# EAGLE design cpu_board (EAGLE 7.2.0)
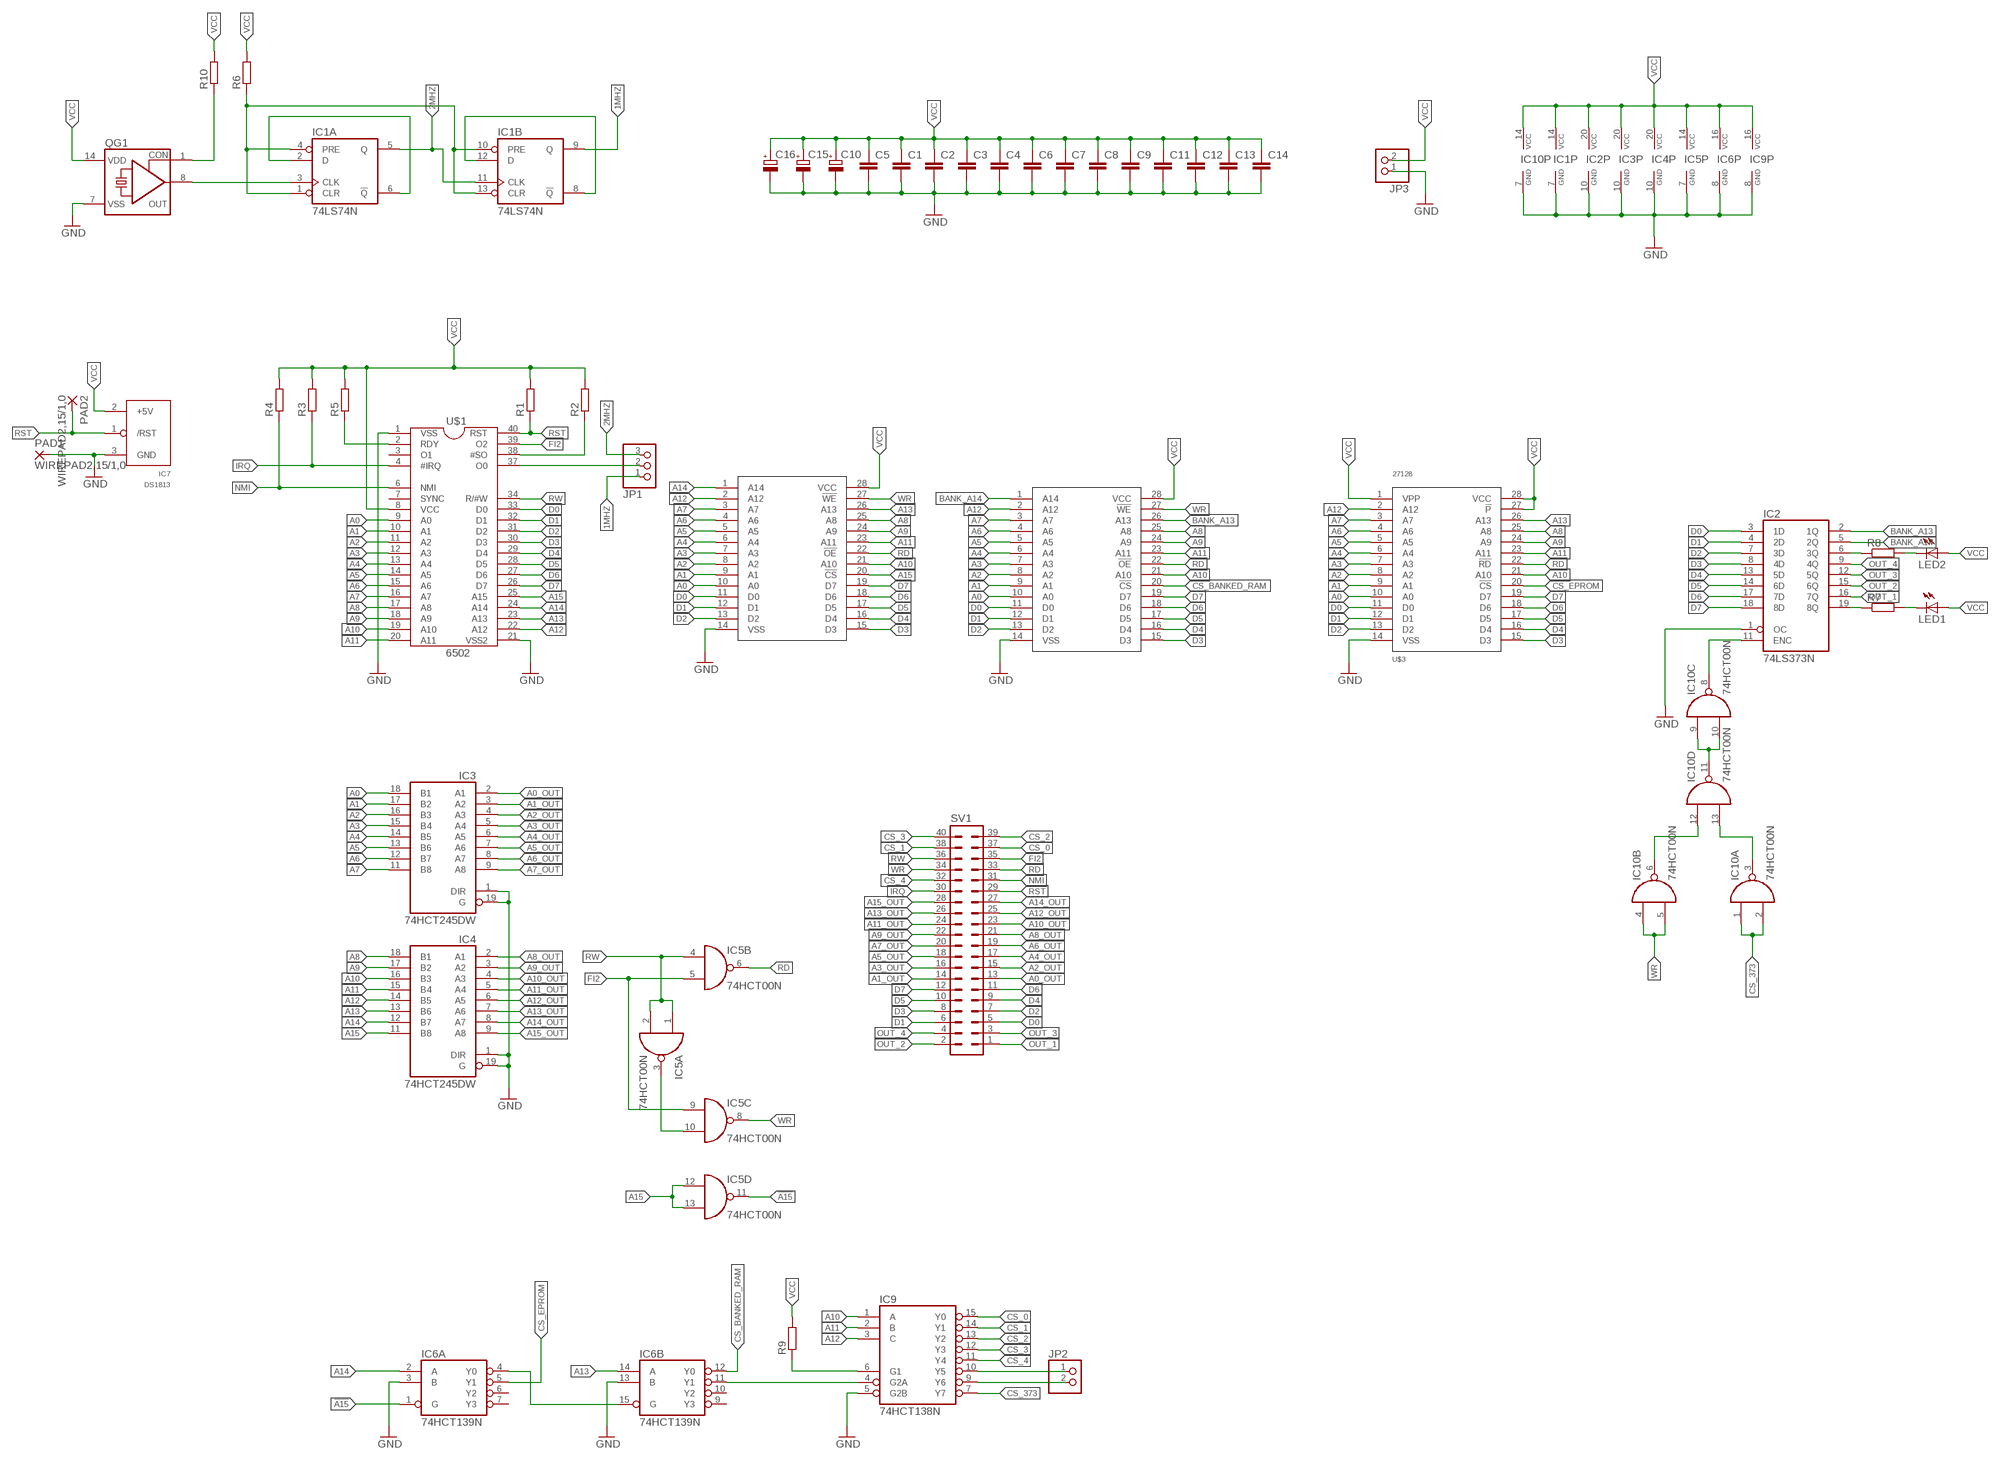
[diagram p0: schematic, sheet 1]

## Parts
C1  C-EUC1206  [C1206]
C2  C-EUC1206  [C1206]
C3  C-EUC1206  [C1206]
C4  C-EUC1206  [C1206]
C5  C-EUC0603  [C0603]
C6  C-EUC1206  [C1206]
C7  C-EUC0603  [C0603]
C8  C-EUC1206  [C1206]
C9  C-EUC1206  [C1206]
C10  CPOL-EUE5-10.5  [E5-10,5]
C11  C-EUC0805  [C0805]
C12  C-EUC0805  [C0805]
C13  C-EUC0805  [C0805]
C14  C-EUC0603  [C0603]
C15  CPOL-EUSMCB  [SMC_B]
C16  CPOL-EUSMCB  [SMC_B]
IC1  74LS74N  [DIL14]
IC2  74LS373N  [DIL20]
IC3  74HCT245DW  [SO20W]
IC4  74HCT245DW  [SO20W]
IC5  74HCT00N  [DIL14]
IC6  74HCT139N  [DIL16]
IC7  DS1813  [TO-92]
IC9  74HCT138N  [DIL16]
IC10  74HCT00N  [DIL14]
JP1  PINHD-1X3  [1X03]
JP2  PINHD-1X2/90  [1X02/90]
JP3  PINHD-1X2/90  [1X02/90]
LED1  LED5MM  [LED5MM]
LED2  LED5MM  [LED5MM]
PAD1  WIREPAD2,15/1,0  [2,15/1,0]
PAD2  WIREPAD2,15/1,0  [2,15/1,0]
QG1  CRYSTAL_RES-SG51  [SG51]
R1  R-EU_R1206  [R1206]
R2  R-EU_R1206  [R1206]
R3  R-EU_R1206  [R1206]
R4  R-EU_R1206  [R1206]
R5  R-EU_R1206  [R1206]
R6  R-EU_M1206  [M1206]
R7  R-EU_R1206  [R1206]
R8  R-EU_R1206  [R1206]
R9  R-EU_0204/7  [0204/7]
R10  R-EU_R1206  [R1206]
SV1  ML40L  [ML40L]
U$1  6502  [DIL40]
U$2  62256  [DIL28-6]
U$3  27128  [DIL28]
U$4  62256  [DIL28-6]

## Nets
1MHZ: IC1.9(B:Q) JP1.1
2MHZ: IC1.5(A:Q) IC1.11(B:CLK) JP1.3
!A15: IC5.11(D:O) IC6.1(A:G)
A0: IC3.18(B1) U$1.9(A0) U$2.10(A0) U$3.10(A0) U$4.10(A0)
A0_OUT: IC3.2(A1) SV1.13
A1: IC3.17(B2) U$1.10(A1) U$2.9(A1) U$3.9(A1) U$4.9(A1)
A1_OUT: IC3.3(A2) SV1.14
A2: IC3.16(B3) U$1.11(A2) U$2.8(A2) U$3.8(A2) U$4.8(A2)
A2_OUT: IC3.4(A3) SV1.15
A3: IC3.15(B4) U$1.12(A3) U$2.7(A3) U$3.7(A3) U$4.7(A3)
A3_OUT: IC3.5(A4) SV1.16
A4: IC3.14(B5) U$1.13(A4) U$2.6(A4) U$3.6(A4) U$4.6(A4)
A4_OUT: IC3.6(A5) SV1.17
A5: IC3.13(B6) U$1.14(A5) U$2.5(A5) U$3.5(A5) U$4.5(A5)
A5_OUT: IC3.7(A6) SV1.18
A6: IC3.12(B7) U$1.15(A6) U$2.4(A6) U$3.4(A6) U$4.4(A6)
A6_OUT: IC3.8(A7) SV1.19
A7: IC3.11(B8) U$1.16(A7) U$2.3(A7) U$3.3(A7) U$4.3(A7)
A7_OUT: IC3.9(A8) SV1.20
A8: IC4.18(B1) U$1.17(A8) U$2.25(A8) U$3.25(A8) U$4.25(A8)
A8_OUT: IC4.2(A1) SV1.21
A9: IC4.17(B2) U$1.18(A9) U$2.24(A9) U$3.24(A9) U$4.24(A9)
A9_OUT: IC4.3(A2) SV1.22
A10: IC4.16(B3) IC9.1(A) U$1.19(A10) U$2.21(A10) U$3.21(A10) U$4.21(A10)
A10_OUT: IC4.4(A3) SV1.23
A11: IC4.15(B4) IC9.2(B) U$1.20(A11) U$2.23(A11) U$3.23(A11) U$4.23(A11)
A11_OUT: IC4.5(A4) SV1.24
A12: IC4.14(B5) IC9.3(C) U$1.22(A12) U$2.2(A12) U$3.2(A12) U$4.2(A12)
A12_OUT: IC4.6(A5) SV1.25
A13: IC4.13(B6) IC6.14(B:A) U$1.23(A13) U$3.26(A13) U$4.26(A13)
A13_OUT: IC4.7(A6) SV1.26
A14: IC4.12(B7) IC6.2(A:A) U$1.24(A14) U$4.1(A14)
A14_OUT: IC4.8(A7) SV1.27
A15: IC4.11(B8) IC5.12(D:I0) IC5.13(D:I1) U$1.25(A15) U$4.20(!CS)
A15_OUT: IC4.9(A8) SV1.28
BANK_A13: IC2.2(1Q) U$2.26(A13)
BANK_A14: IC2.5(2Q) U$2.1(A14)
CS_0: IC9.15(Y0) SV1.37
CS_1: IC9.14(Y1) SV1.38
CS_2: IC9.13(Y2) SV1.39
CS_3: IC9.12(Y3) SV1.40
CS_4: IC9.11(Y4) SV1.32
CS_373: IC9.7(Y7) IC10.1(A:I0) IC10.2(A:I1)
CS_BANKED_RAM: IC6.12(B:Y0) U$2.20(!CS)
CS_EPROM: IC6.5(A:Y1) U$3.20(!CS)
D0: IC2.3(1D) SV1.5 U$1.33(D0) U$2.11(D0) U$3.11(D0) U$4.11(D0)
D1: IC2.4(2D) SV1.6 U$1.32(D1) U$2.12(D1) U$3.12(D1) U$4.12(D1)
D2: IC2.7(3D) SV1.7 U$1.31(D2) U$2.13(D2) U$3.13(D2) U$4.13(D2)
D3: IC2.8(4D) SV1.8 U$1.30(D3) U$2.15(D3) U$3.15(D3) U$4.15(D3)
D4: IC2.13(5D) SV1.9 U$1.29(D4) U$2.16(D4) U$3.16(D4) U$4.16(D4)
D5: IC2.14(6D) SV1.10 U$1.28(D5) U$2.17(D5) U$3.17(D5) U$4.17(D5)
D6: IC2.17(7D) SV1.11 U$1.27(D6) U$2.18(D6) U$3.18(D6) U$4.18(D6)
D7: IC2.18(8D) SV1.12 U$1.26(D7) U$2.19(D7) U$3.19(D7) U$4.19(D7)
FI2: IC5.5(B:I1) IC5.9(C:I0) SV1.35 U$1.39(O2)
GND: C1.2 C2.2 C3.2 C4.2 C5.2 C6.2 C7.2 C8.2 C9.2 C10.- C11.2 C12.2 C13.2 C14.2 C15.- C16.- IC1.7(P:GND) IC2.1(OC) IC2.10(GND) IC3.1(DIR) IC3.10(GND) IC3.19(G) IC4.1(DIR) IC4.10(GND) IC4.19(G) IC5.7(P:GND) IC6.3(A:B) IC6.8(P:GND) IC6.13(B:B) IC7.3(GND) IC9.5(G2B) IC9.8(GND) IC10.7(P:GND) JP3.1 PAD1.1(P) QG1.7(VSS) U$1.1(VSS) U$1.21(VSS2) U$2.14(VSS) U$3.14(VSS) U$4.14(VSS)
IRQ: R3.1 SV1.30 U$1.4(#IRQ)
N$1: IC1.1(A:CLR) IC1.4(A:PRE) IC1.10(B:PRE) IC1.13(B:CLR) R6.1
N$2: R2.1 U$1.38(#SO)
N$3: IC2.19(8Q) R7.1
N$4: LED1.K(C) R7.2
N$5: R5.1 U$1.2(RDY)
N$6: JP1.2 U$1.37(O0)
N$7: QG1.1(CON) R10.1
N$8: IC1.3(A:CLK) QG1.8(OUT)
N$9: IC1.2(A:D) IC1.6(A:!Q)
N$10: IC1.8(B:!Q) IC1.12(B:D)
N$11: IC2.11(ENC) IC10.8(C:O)
N$12: IC10.9(C:I0) IC10.10(C:I1) IC10.11(D:O)
N$13: IC10.3(A:O) IC10.13(D:I1)
N$14: IC10.6(B:O) IC10.12(D:I0)
N$15: IC2.6(3Q) R8.1
N$16: IC9.10(Y5) JP2.1
N$17: LED2.K(C) R8.2
N$18: IC5.3(A:O) IC5.10(C:I1)
N$19: IC6.4(A:Y0) IC6.15(B:G)
N$20: IC9.6(G1) R9.1
N$21: IC6.11(B:Y1) IC9.4(G2A)
N$22: IC9.9(Y6) JP2.2
NMI: R4.1 SV1.31 U$1.6(NMI)
OUT_1: IC2.16(7Q) SV1.1
OUT_2: IC2.15(6Q) SV1.2
OUT_3: IC2.12(5Q) SV1.3
OUT_4: IC2.9(4Q) SV1.4
RD: IC5.6(B:O) SV1.33 U$2.22(!OE) U$3.22(!RD) U$4.22(!OE)
RST: IC7.1(/RST) PAD2.1(P) R1.1 SV1.29 U$1.40(RST)
RW: IC5.1(A:I0) IC5.2(A:I1) IC5.4(B:I0) SV1.36 U$1.34(R/#W)
VCC: C1.1 C2.1 C3.1 C4.1 C5.1 C6.1 C7.1 C8.1 C9.1 C10.+ C11.1 C12.1 C13.1 C14.1 C15.+ C16.+ IC1.14(P:VCC) IC2.20(VCC) IC3.20(VCC) IC4.20(VCC) IC5.14(P:VCC) IC6.16(P:VCC) IC7.2(+5V) IC9.16(VCC) IC10.14(P:VCC) JP3.2 LED1.A LED2.A QG1.14(VDD) R1.2 R2.2 R3.2 R4.2 R5.2 R6.2 R9.2 R10.2 U$1.8(VCC) U$2.28(VCC) U$3.1(VPP) U$3.27(!P) U$3.28(VCC) U$4.28(VCC)
WR: IC5.8(C:O) IC10.4(B:I0) IC10.5(B:I1) SV1.34 U$2.27(!WE) U$4.27(!WE)
Unconnected: IC6.6(A:Y2) IC6.7(A:Y3) IC6.9(B:Y3) IC6.10(B:Y2) U$1.3(O1) U$1.7(SYNC)

## Library data of the parts
C1-C9 C11-C14 = rcl:C-EU: CAPACITOR, European symbol
C10 C15 C16 = rcl:CPOL-EU: POLARIZED CAPACITOR, European symbol
IC1 = 74xx-eu:74*74: Dual D type positive edge triggered FLIP FLOP, preset and clear
IC2 = 74xx-eu:74*373: Octal D type transparent LATCH, edge triggered
IC3 IC4 = 74xx-eu:74*245: Octal BUS TRANSCEIVER, 3-state
IC5 IC10 = 74xx-eu:74*00: Quad 2-input NAND gate
IC6 = 74xx-eu:74*139: Dual 2-line to 4-line DECODER/DEMULTIPLEXER
IC7 = ds1813_revised:DS1813
IC9 = 74xx-eu:74*138: 3-line to 8-line DECODER/DEMULTIPLEXER
JP1 = pinhead:PINHD-1X3: PIN HEADER
JP2 JP3 = pinhead:PINHD-1X2: PIN HEADER
LED1 LED2 = led:LED: LED OSRAM: - CHIPLED LG R971, LG N971, LY N971, LG Q971, LY Q971, LO R971, LY R971 LH N974, LH R974 LS Q976, LO Q976, LY Q976 LO Q996 - Hyper CHIPLED LW Q18S LB Q993, LB Q99A, LB R99A - SideLED LS A670, LO A670, LY A670, LG A670, LP A670 LB A673, LV A673, LT A673, LW A673 LH A674 LY A675 LS A676, LA A676, LO A676, LY A676, LW A676 LS A679, LY A679, LG A679 - Hyper Micro SIDELED® LS Y876, LA Y876, LO Y876, LY Y876 LT Y87S - SmartLED LW L88C, LW L88S LB L89C, LB L89S, LG L890 LS L89K, LO L89K, LY L89K LS L896, LA L896, LO L896, LY L896 - TOPLED LS T670, LO T670, LY T670, LG T670, LP T670 LSG T670, LSP T670, LSY T670, LOP T670, LYG T670 LG T671, LOG T671, LSG T671 LB T673, LV T673, LT T673, LW T673 LH T674 LS T676, LA T676, LO T676, LY T676, LB T676, LH T676, LSB T676, LW T676 LB T67C, LV T67C, LT T67C, LS T67K, LO T67K, LY T67K, LW E67C LS E67B, LA E67B, LO E67B, LY E67B, LB E67C, LV E67C, LT E67C LW T67C LS T679, LY T679, LG T679 LS T770, LO T770, LY T770, LG T770, LP T770 LB T773, LV T773, LT T773, LW T773 LH T774 LS E675, LA E675, LY E675, LS T675 LS T776, LA T776, LO T776, LY T776, LB T776 LHGB T686 LT T68C, LB T68C - Hyper Mini TOPLED® LB M676 - Mini TOPLED Santana® LG M470 LS M47K, LO M47K, LY M47K Source: http://www.osram.convergy.de LUXEON: - LUMILED® LXK2-PW12-R00, LXK2-PW12-S00, LXK2-PW14-U00, LXK2-PW14-V00 LXK2-PM12-R00, LXK2-PM12-S00, LXK2-PM14-U00 LXK2-PE12-Q00, LXK2-PE12-R00, LXK2-PE12-S00, LXK2-PE14-T00, LXK2-PE14-U00 LXK2-PB12-K00, LXK2-PB12-L00, LXK2-PB12-M00, LXK2-PB14-N00, LXK2-PB14-P00, LXK2-PB14-Q00 LXK2-PR12-L00, LXK2-PR12-M00, LXK2-PR14-Q00, LXK2-PR14-R00 LXK2-PD12-Q00, LXK2-PD12-R00, LXK2-PD12-S00 LXK2-PH12-R00, LXK2-PH12-S00 LXK2-PL12-P00, LXK2-PL12-Q00, LXK2-PL12-R00 Source: www.luxeon.com KINGBRIGHT: KA-3528ASYC Source: www.kingbright.com
PAD1 PAD2 = wirepad:WIREPAD: Wire PAD connect wire on PCB
QG1 = crystal:CRYSTAL_RES-: CRYSTAL RESONATOR; OC_FARNELL: unknown; OC_NEWARK: unknown
R1-R10 = rcl:R-EU_: RESISTOR, European symbol
SV1 = con-harting-ml:ML40: HARTING; OC_FARNELL: unknown; OC_NEWARK: unknown
U$1 = Mos6502:6502: * 65k Addressable Bytes of Memory (A0-A15) * #IRQ Interrupt * On Chip Clock: - TTL Level Single Phase Input - RC Time Base Input - Crystal Time Base Input * SYNC Signal (can be used for single instr. ex.) * RDY Signal (halt/signle ex.) * Two Phase Output Clock * #NMI Interrupt
U$2 U$4 = memory-sram:62256
U$3 = mw:27128

## Board
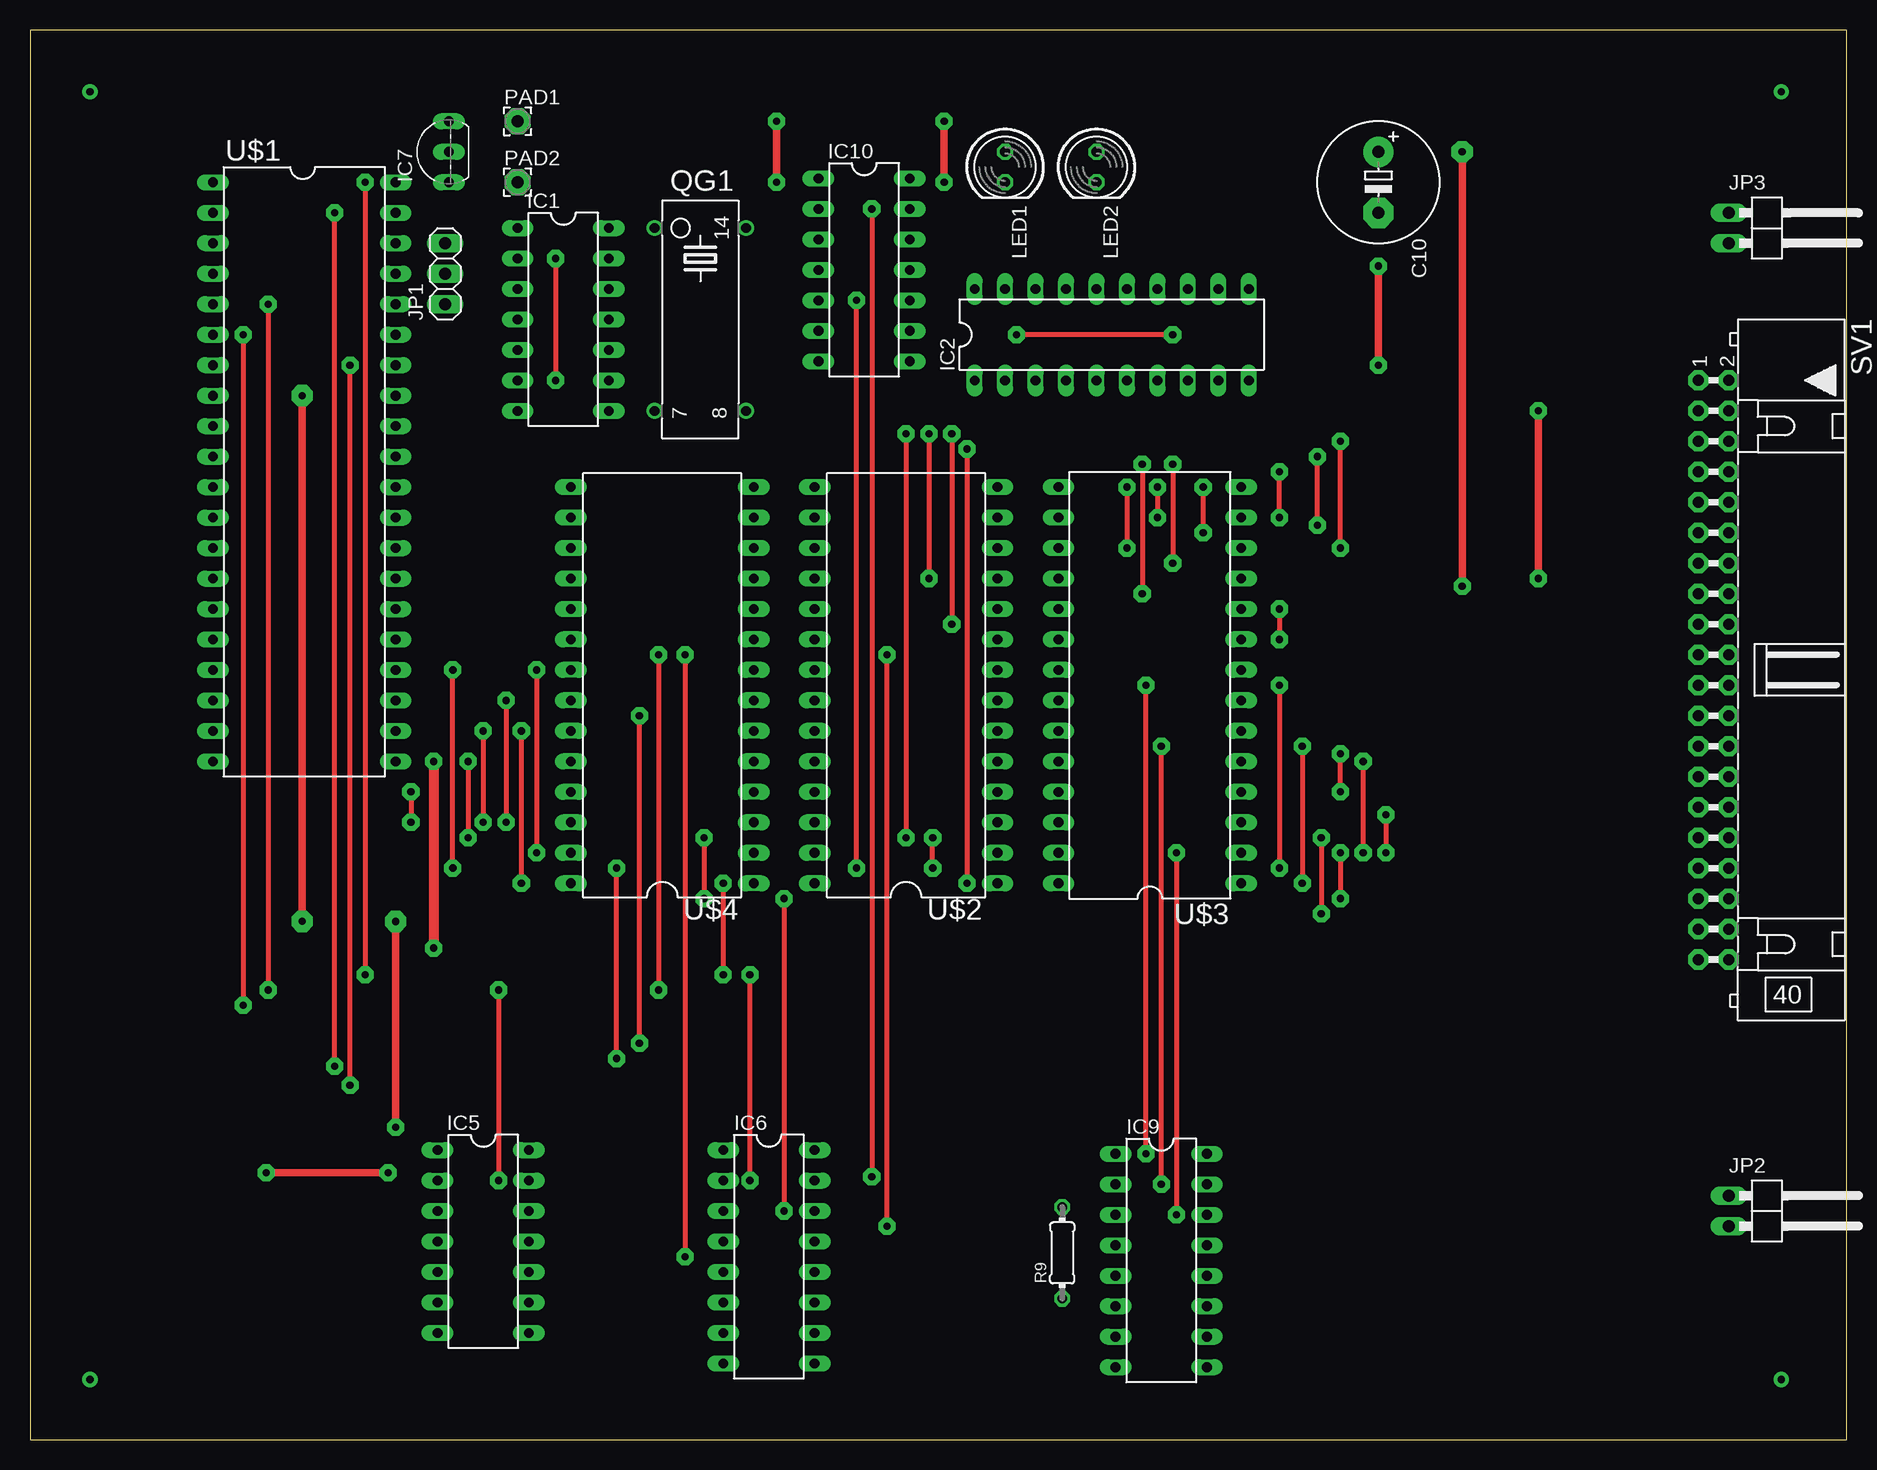
[diagram p1: board, top side]
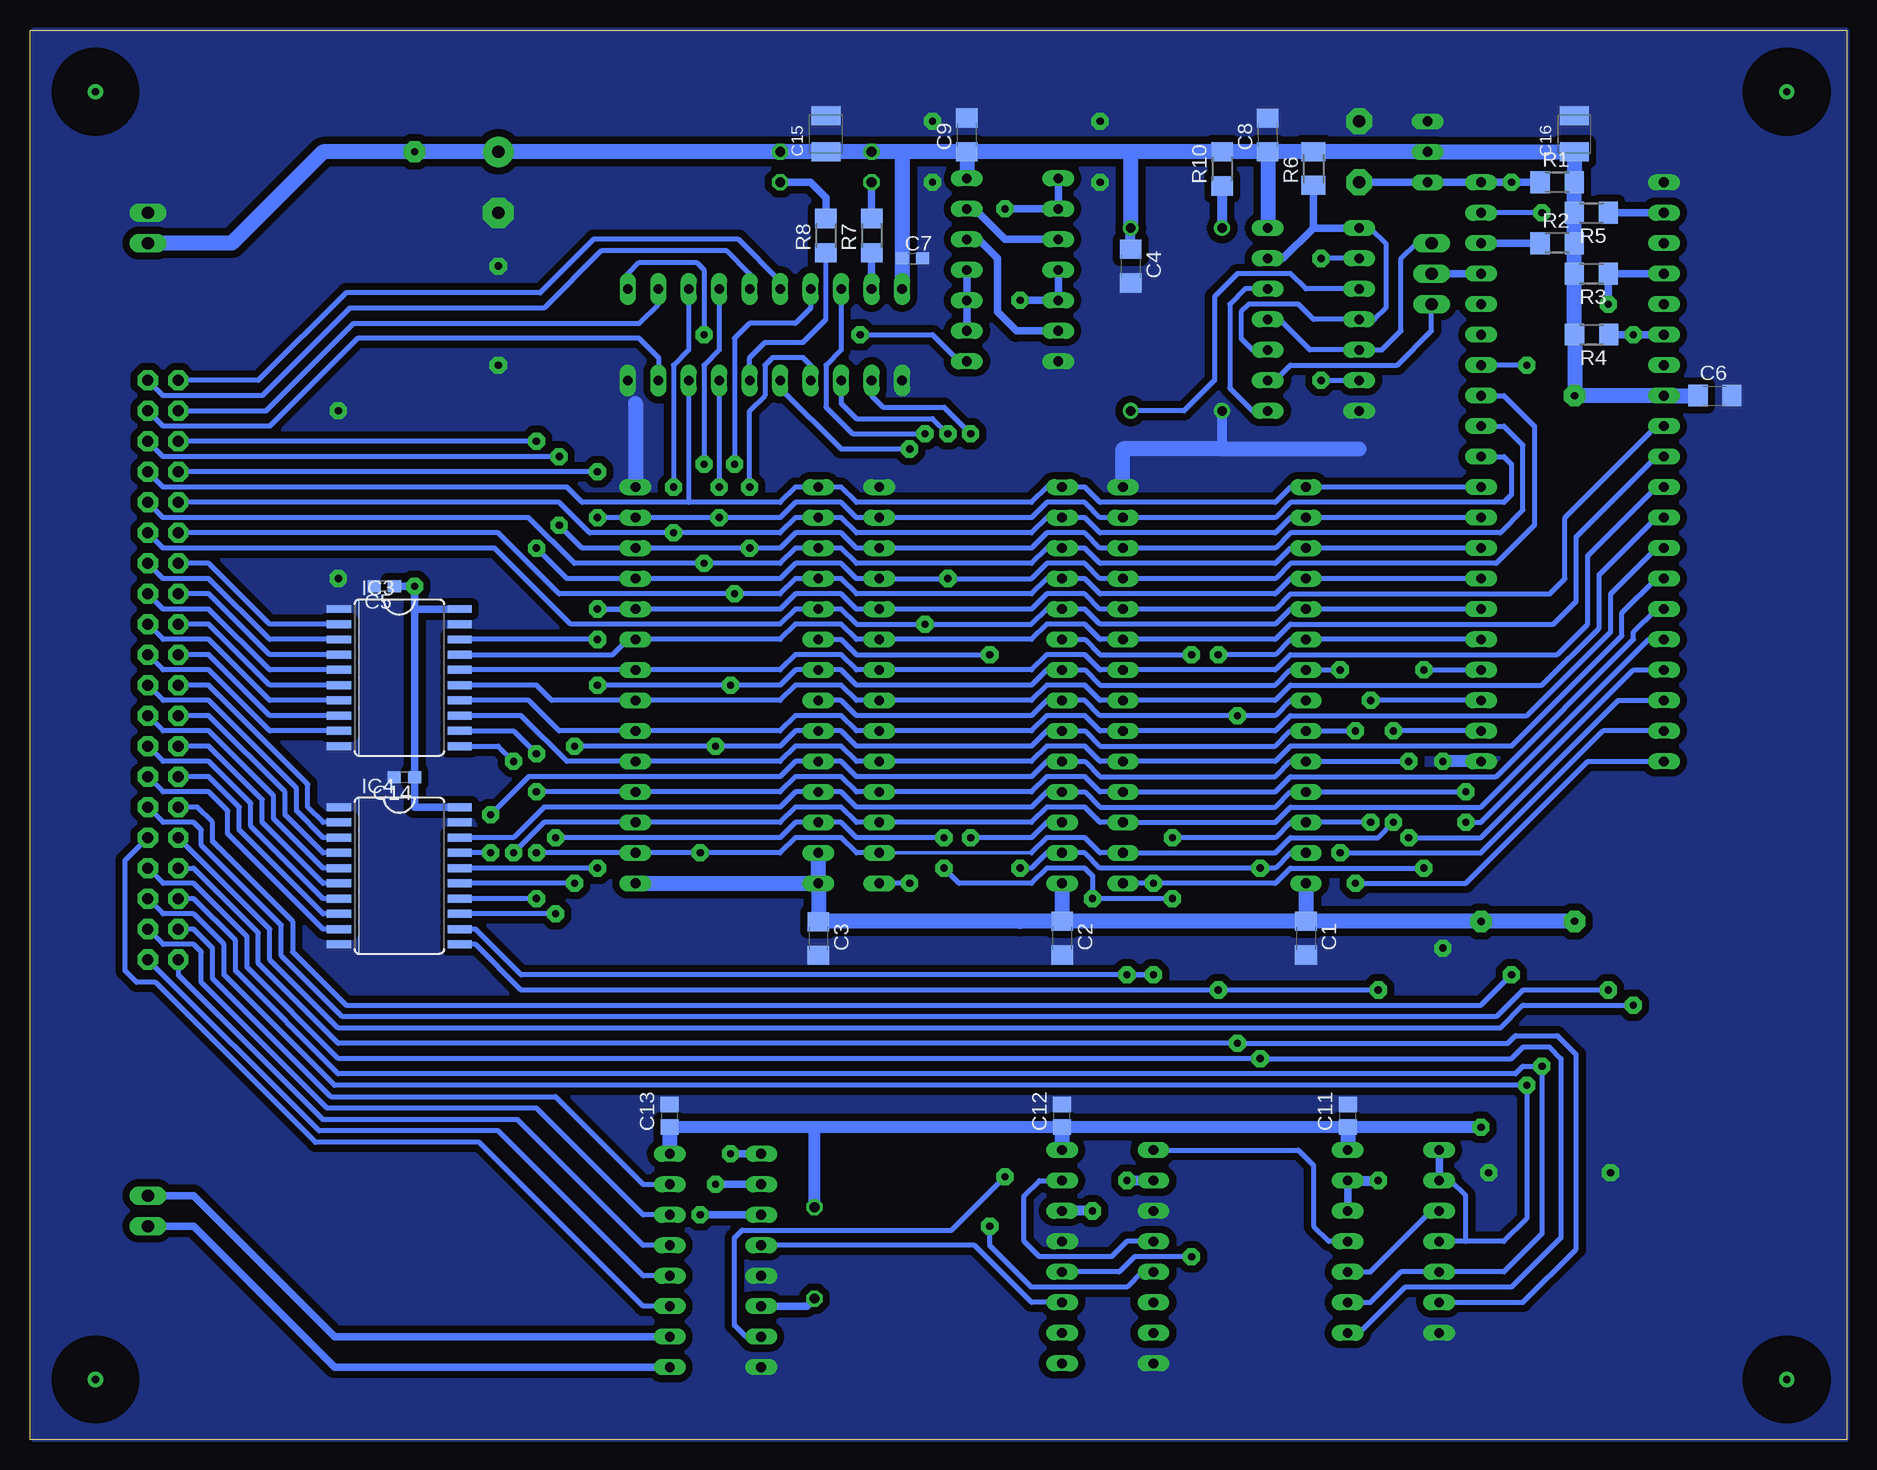
[diagram p2: board, bottom side, seen from below]

Size 151.44 x 117.47 mm. Coordinates in mm from the lower left corner, seen from the top.
Outline: 0,0 151.44,0 151.44,117.47 0,117.47 0,0
Copper layers (1*16): Top 0.035mm / dielectric 1.5mm / Bottom 0.035mm
Design rules "default *": minimum track width 10mil, minimum drill 24mil, track to track 8mil, track to pad 8mil, pad to pad 8mil, via to via 8mil, smd to smd 8mil, copper to edge 0mil, drill to drill 8mil, minimum pad ring 10mil, minimum via ring 8mil, stop-mask expansion 4mil, vias tented up to drill 0mil, thermal gap 10mil
bRestrict: area 2,2 to 8,8; area 2,109.3 to 8,115.4; area 142.9,2 to 149,8; area 142.9,109.3 to 149,115.4

### Footprints (pad centres in the part's own frame; a part is rotated, then mirrored left to right if it is on the bottom)
C1206 = smd 1.6 x 1.8: 1 -1.4,0; 2 1.4,0
C0603 = smd 1.1 x 1: 1 -0.85,0; 2 0.85,0
E5-10,5 = drill 1.016 pad 2.54: + -2.54,0 | drill 1.016 pad 2.54 octagon: - 2.54,0
C0805 = smd 1.3 x 1.5: 1 -0.95,0; 2 0.95,0
SMC_B = smd 1.6 x 2.4: + -1.5,0; - 1.5,0
DIL14 = drill 0.813 long: 1 -7.62,-3.81; 2 -5.08,-3.81; 3 -2.54,-3.81; 4 0,-3.81; 5 2.54,-3.81; 6 5.08,-3.81; 7 7.62,-3.81; 8 7.62,3.81; 9 5.08,3.81; 10 2.54,3.81; 11 0,3.81; 12 -2.54,3.81; 13 -5.08,3.81; 14 -7.62,3.81
DIL20 = drill 0.813 long: 1 -11.43,-3.81; 2 -8.89,-3.81; 3 -6.35,-3.81; 4 -3.81,-3.81; 5 -1.27,-3.81; 6 1.27,-3.81; 7 3.81,-3.81; 8 6.35,-3.81; 9 8.89,-3.81; 10 11.43,-3.81; 11 11.43,3.81; 12 8.89,3.81; 13 6.35,3.81; 14 3.81,3.81; 15 1.27,3.81; 16 -1.27,3.81; 17 -3.81,3.81; 18 -6.35,3.81; 19 -8.89,3.81; 20 -11.43,3.81
SO20W = smd 0.66 x 2.032: 1 -5.715,-5.029; 2 -4.445,-5.029; 3 -3.175,-5.029; 4 -1.905,-5.029; 5 -0.635,-5.029; 6 0.635,-5.029; 7 1.905,-5.029; 8 3.175,-5.029; 9 4.445,-5.029; 10 5.715,-5.029; 11 5.715,5.029; 12 4.445,5.029; 13 3.175,5.029; 14 1.905,5.029; 15 0.635,5.029; 16 -0.635,5.029; 17 -1.905,5.029; 18 -3.175,5.029; 19 -4.445,5.029; 20 -5.715,5.029
DIL16 = drill 0.813 long: 1 -8.89,-3.81; 2 -6.35,-3.81; 3 -3.81,-3.81; 4 -1.27,-3.81; 5 1.27,-3.81; 6 3.81,-3.81; 7 6.35,-3.81; 8 8.89,-3.81; 9 8.89,3.81; 10 6.35,3.81; 11 3.81,3.81; 12 1.27,3.81; 13 -1.27,3.81; 14 -3.81,3.81; 15 -6.35,3.81; 16 -8.89,3.81
TO-92 = drill 0.813 long: 1 -2.54,0; 2 0,0; 3 2.54,0
1X03 = drill 1.016 long: 1 -2.54,0; 2 0,0; 3 2.54,0
1X02/90 = drill 1.016 long: 1 -1.27,-3.81; 2 1.27,-3.81
LED5MM = drill 0.813 octagon: A -1.27,0; K 1.27,0
2,15/1,0 = drill 1.016 pad 2.159 octagon: 1 0,0
SG51 = drill 0.813: 1 -7.62,-3.81; 7 7.62,-3.81; 8 7.62,3.81; 14 -7.62,3.81
R1206 = smd 1.6 x 1.803: 1 -1.422,0; 2 1.422,0
M1206 = smd 1.6 x 2: 1 -1.4,0; 2 1.4,0
0204/7 = drill 0.813 octagon: 1 -3.81,0; 2 3.81,0
ML40L = drill 0.914 pad 1.676 octagon: 1 -24.13,-1.27; 2 -24.13,1.27; 3 -21.59,-1.27; 4 -21.59,1.27; 5 -19.05,-1.27; 6 -19.05,1.27; 7 -16.51,-1.27; 8 -16.51,1.27; 9 -13.97,-1.27; 10 -13.97,1.27; 11 -11.43,-1.27; 12 -11.43,1.27; 13 -8.89,-1.27; 14 -8.89,1.27; 15 -6.35,-1.27; 16 -6.35,1.27; 17 -3.81,-1.27; 18 -3.81,1.27; 19 -1.27,-1.27; 20 -1.27,1.27; 21 1.27,-1.27; 22 1.27,1.27; 23 3.81,-1.27; 24 3.81,1.27; 25 6.35,-1.27; 26 6.35,1.27; 27 8.89,-1.27; 28 8.89,1.27; 29 11.43,-1.27; 30 11.43,1.27; 31 13.97,-1.27; 32 13.97,1.27; 33 16.51,-1.27; 34 16.51,1.27; 35 19.05,-1.27; 36 19.05,1.27; 37 21.59,-1.27; 38 21.59,1.27; 39 24.13,-1.27; 40 24.13,1.27
DIL40 = drill 0.813 long: 1 -24.13,-7.62; 2 -21.59,-7.62; 3 -19.05,-7.62; 4 -16.51,-7.62; 5 -13.97,-7.62; 6 -11.43,-7.62; 7 -8.89,-7.62; 8 -6.35,-7.62; 9 -3.81,-7.62; 10 -1.27,-7.62; 11 1.27,-7.62; 12 3.81,-7.62; 13 6.35,-7.62; 14 8.89,-7.62; 15 11.43,-7.62; 16 13.97,-7.62; 17 16.51,-7.62; 18 19.05,-7.62; 19 21.59,-7.62; 20 24.13,-7.62; 21 24.13,7.62; 22 21.59,7.62; 23 19.05,7.62; 24 16.51,7.62; 25 13.97,7.62; 26 11.43,7.62; 27 8.89,7.62; 28 6.35,7.62; 29 3.81,7.62; 30 1.27,7.62; 31 -1.27,7.62; 32 -3.81,7.62; 33 -6.35,7.62; 34 -8.89,7.62; 35 -11.43,7.62; 36 -13.97,7.62; 37 -16.51,7.62; 38 -19.05,7.62; 39 -21.59,7.62; 40 -24.13,7.62
DIL28-6 = drill 0.813 long: 1 -16.51,-7.62; 2 -13.97,-7.62; 3 -11.43,-7.62; 4 -8.89,-7.62; 5 -6.35,-7.62; 6 -3.81,-7.62; 7 -1.27,-7.62; 8 1.27,-7.62; 9 3.81,-7.62; 10 6.35,-7.62; 11 8.89,-7.62; 12 11.43,-7.62; 13 13.97,-7.62; 14 16.51,-7.62; 15 16.51,7.62; 16 13.97,7.62; 17 11.43,7.62; 18 8.89,7.62; 19 6.35,7.62; 20 3.81,7.62; 21 1.27,7.62; 22 -1.27,7.62; 23 -3.81,7.62; 24 -6.35,7.62; 25 -8.89,7.62; 26 -11.43,7.62; 27 -13.97,7.62; 28 -16.51,7.62
DIL28 = drill 0.813 long: 1 -16.51,-7.62; 2 -13.97,-7.62; 3 -11.43,-7.62; 4 -8.89,-7.62; 5 -6.35,-7.62; 6 -3.81,-7.62; 7 -1.27,-7.62; 8 1.27,-7.62; 9 3.81,-7.62; 10 6.35,-7.62; 11 8.89,-7.62; 12 11.43,-7.62; 13 13.97,-7.62; 14 16.51,-7.62; 15 16.51,7.62; 16 13.97,7.62; 17 11.43,7.62; 18 8.89,7.62; 19 6.35,7.62; 20 3.81,7.62; 21 1.27,7.62; 22 -1.27,7.62; 23 -3.81,7.62; 24 -6.35,7.62; 25 -8.89,7.62; 26 -11.43,7.62; 27 -13.97,7.62; 28 -16.51,7.62

### Placement (x,y rotation side)
C1  45.09,41.78 270 bottom
C2  65.41,41.78 270 bottom
C3  85.72,41.76 270 bottom
C4  59.69,97.79 270 bottom
C5  121.91,71.12 180 bottom
C6  10.99,87 0 bottom
C7  77.89,98.42 0 bottom
C8  48.26,108.71 90 bottom
C9  73.34,108.72 90 bottom
C10  112.39,104.78 270 top
C11  41.59,26.99 90 bottom
C12  65.41,26.99 90 bottom
C13  98.11,26.99 90 bottom
C14  120.23,55.18 180 bottom
C15  85.09,108.81 90 bottom
C16  22.71,108.81 90 bottom
IC1  44.45,93.34 270 top
IC2  90.17,92.08 0 top
IC3  120.65,63.5 270 bottom
IC4  120.65,46.99 270 bottom
IC5  37.78,16.51 270 top
IC6  61.59,15.24 270 top
IC7  34.92,107.31 90 top
IC9  94.3,14.92 270 top
IC10  69.53,97.47 270 top
JP1  34.61,97.16 90 top
JP2  145.41,19.05 270 top
JP3  145.41,100.97 270 top
LED1  81.28,106.05 270 top
LED2  88.9,106.05 270 top
PAD1  40.64,109.86 0 top
PAD2  40.64,104.78 0 top
QG1  55.88,93.34 270 top
R1  24.13,104.78 0 bottom
R2  24.13,99.69 0 bottom
R3  21.29,97.16 180 bottom
R4  21.26,92.08 180 bottom
R5  21.29,102.23 180 bottom
R6  44.45,105.92 90 bottom
R7  81.28,100.33 90 bottom
R8  85.09,100.33 90 bottom
R9  86.04,15.56 90 top
R10  52.07,105.89 90 bottom
SV1  140.34,64.14 270 top
U$1  22.86,80.64 270 top
U$2  73.03,62.87 90 top
U$3  93.34,62.87 90 top
U$4  52.7,62.87 90 top

### Tracks (layer width: path | path; a pad name or v marks a point on that pad's centre or on a via)
1MHZ
  Bottom 0.406: IC1.9 47.62,88.27 46.35,89.53 37.47,89.53 34.61,92.39 JP1.1
2MHZ
  Bottom 0.406: IC1.11 47.31,93.34 44.77,90.81 IC1.5 38.73,90.81 37.15,92.39 37.15,98.42 35.88,99.69 JP1.3
!A15
  Bottom 0.406: 40.64,16.51 IC5.11 43.18,16.51 44.45,17.78 44.45,22.86 45.72,24.13 IC6.1
A0  (via drill 0.6 pad 1.42)
  Top 0.406: v104.14,69.22 v104.14,66.67
  Bottom 0.406: U$1.9 15.88,84.45 23.5,76.83 23.5,71.75 24.77,70.48 46.35,70.48 47.62,69.22 U$4.10 62.23,69.22 63.5,70.48 66.67,70.48 67.94,69.22 U$2.10 82.55,69.22 83.82,70.48 87.63,70.48 88.9,69.22 v104.14,69.22 U$3.10 | v104.14,66.67 IC3.18
A0_OUT
  Bottom 0.406: IC3.2 131.44,67.94 136.53,73.03 SV1.13
A1
  Bottom 0.406: U$1.10 15.88,81.92 22.54,75.25 22.54,69.85 24.45,67.94 46.35,67.94 47.62,66.67 U$4.9 62.23,66.67 63.5,67.94 66.67,67.94 67.94,66.67 U$2.9 82.55,66.67 83.82,67.94 87.63,67.94 88.9,66.67 U$3.9 101.6,66.67 102.87,65.41 IC3.17
A1_OUT
  Bottom 0.406: IC3.3 131.44,66.67 136.53,71.75 140.34,71.75 SV1.14
A2
  Bottom 0.406: U$1.11 15.88,79.38 21.59,73.66 21.59,67.94 24.13,65.41 46.35,65.41 47.62,64.14 U$4.8 62.23,64.14 63.5,65.41 66.67,65.41 67.94,64.14 U$2.8 82.55,64.14 83.82,65.41 87.63,65.41 88.9,64.14 U$3.8 IC3.16
A2_OUT
  Bottom 0.406: IC3.4 131.44,65.41 136.53,70.48 SV1.15
A3
  Bottom 0.406: U$1.12 15.88,76.83 20.64,72.07 20.64,67.63 25.4,62.87 46.35,62.87 47.62,61.59 U$4.7 62.23,61.59 63.5,62.87 66.67,62.87 67.94,61.59 U$2.7 82.55,61.59 83.82,62.87 87.63,62.87 88.9,61.59 U$3.7 107.95,61.59 109.22,62.87 IC3.15
A3_OUT
  Bottom 0.406: IC3.5 131.44,64.14 136.53,69.22 140.34,69.22 SV1.16
A4
  Bottom 0.406: U$1.13 15.88,74.3 19.68,70.48 19.68,67.31 26.67,60.33 46.35,60.33 47.62,59.05 U$4.6 62.23,59.05 63.5,60.33 66.67,60.33 67.94,59.05 U$2.6 82.55,59.05 83.82,60.33 87.63,60.33 88.9,59.05 U$3.6 107.31,59.05 109.86,61.59 IC3.14
A4_OUT
  Bottom 0.406: IC3.6 131.44,62.87 136.53,67.94 SV1.17
A5
  Bottom 0.406: U$1.14 15.88,71.75 18.73,68.9 18.73,66.99 27.94,57.78 46.35,57.78 47.62,56.52 U$4.5 62.23,56.52 63.5,57.78 66.67,57.78 67.94,56.52 U$2.5 82.55,56.52 83.82,57.78 87.63,57.78 88.9,56.52 U$3.5 106.68,56.52 110.49,60.33 IC3.13
A5_OUT
  Bottom 0.406: IC3.7 131.44,61.59 136.53,66.67 140.34,66.67 SV1.18
A6  (via drill 0.6 pad 1.42)
  Top 0.406: v109.22,53.98 v109.22,57.15
  Bottom 0.406: v109.22,53.98 U$3.4 88.9,53.98 87.63,55.24 83.82,55.24 82.55,53.98 U$2.4 67.94,53.98 66.67,55.24 63.5,55.24 62.23,53.98 U$4.4 47.62,53.98 46.35,55.24 29.21,55.24 17.78,66.67 17.78,67.31 15.88,69.22 U$1.15 | IC3.12 111.12,59.05 v109.22,57.15
A6_OUT
  Bottom 0.406: IC3.8 131.44,60.33 136.53,65.41 SV1.19
A7  (via drill 0.6 pad 1.42)
  Top 0.406: v111.12,48.9 v111.12,56.52
  Bottom 0.406: U$1.16 16.51,66.67 30.48,52.7 46.35,52.7 47.62,51.44 U$4.3 62.23,51.44 63.5,52.7 66.67,52.7 67.94,51.44 U$2.3 82.55,51.44 83.82,52.7 87.63,52.7 88.9,51.44 U$3.3 108.58,51.44 v111.12,48.9 | IC3.11 112.39,57.78 v111.12,56.52
A7_OUT
  Bottom 0.406: IC3.9 131.44,59.05 136.53,64.14 140.34,64.14 SV1.20
A8  (via drill 0.6 pad 1.42)
  Top 0.406: v31.75,53.98 v31.75,51.44
  Bottom 0.406: v31.75,53.98 U$4.25 46.35,53.98 47.62,52.7 62.23,52.7 63.5,53.98 U$2.25 66.67,53.98 67.94,52.7 82.55,52.7 83.82,53.98 U$3.25 87.63,53.98 88.9,52.7 108.58,52.7 111.12,50.16 IC4.18 | U$1.17 17.78,64.14 30.48,51.44 v31.75,51.44
A8_OUT
  Bottom 0.406: IC4.2 127,51.44 128.27,52.7 128.27,54.61 136.53,62.87 SV1.21
A9  (via drill 0.6 pad 1.42)
  Top 0.406: v36.51,56.52 v36.51,50.16 | v113.03,52.07 v113.03,48.9
  Bottom 0.406: v36.51,56.52 U$4.24 46.35,56.52 47.62,55.24 62.23,55.24 63.5,56.52 U$2.24 66.67,56.52 67.94,55.24 82.55,55.24 83.82,56.52 U$3.24 87.63,56.52 88.9,55.24 109.86,55.24 v113.03,52.07 | U$1.18 19.05,61.59 30.48,50.16 v36.51,50.16 | v113.03,48.9 IC4.17
A9_OUT
  Bottom 0.406: IC4.3 127,50.16 129.22,52.39 129.22,54.29 136.53,61.59 140.34,61.59 SV1.22
A10  (via drill 0.6 pad 1.42)
  Top 0.406: v42.23,64.14 v42.23,48.9 | v104.14,62.87 v104.14,47.62 | v93.03,23.81 v93.03,62.87
  Bottom 0.406: v42.23,64.14 U$4.21 46.35,64.14 47.62,62.87 62.23,62.87 63.5,64.14 U$2.21 66.67,64.14 67.94,62.87 82.55,62.87 83.82,64.14 U$3.21 87.63,64.14 88.9,62.87 v93.03,62.87 v104.14,62.87 | v42.23,48.9 30.48,48.9 20.32,59.05 U$1.19 | v104.14,47.62 IC4.16
  Bottom 0.61: IC9.1 v93.03,23.81
A10_OUT
  Bottom 0.406: IC4.4 127,48.9 130.18,52.07 130.18,53.98 136.53,60.33 SV1.23
A11  (via drill 0.6 pad 1.42)
  Top 0.406: v40.96,59.05 v40.96,46.35 | v106.05,57.78 v106.05,46.35 | v94.3,21.27 v94.3,57.78
  Bottom 0.406: v40.96,59.05 U$4.23 46.35,59.05 47.62,57.78 62.23,57.78 63.5,59.05 U$2.23 66.67,59.05 67.94,57.78 82.55,57.78 83.82,59.05 U$3.23 87.63,59.05 88.9,57.78 v94.3,57.78 v106.05,57.78 | v40.96,46.35 31.75,46.35 21.59,56.52 U$1.20 | v106.05,46.35 IC4.15
  Bottom 0.61: IC9.2 v94.3,21.27
A11_OUT
  Bottom 0.406: IC4.5 127,47.62 131.13,51.75 131.13,53.66 136.53,59.05 140.34,59.05 SV1.24
A12  (via drill 0.6 pad 1.42)
  Top 0.406: v37.78,59.05 v37.78,51.44 | v109.22,48.9 v109.22,45.09 | v95.57,48.9 v95.57,18.73
  Bottom 0.305: 67.94,48.9 U$2.2
  Bottom 0.406: U$2.2 82.55,48.9 83.82,50.16 87.63,50.16 88.9,48.9 v95.57,48.9 U$3.2 v109.22,48.9 | 67.94,48.9 66.67,50.16 63.5,50.16 62.23,48.9 U$4.2 47.62,48.9 46.35,50.16 39.05,50.16 v37.78,51.44 | U$1.22 v37.78,59.05 | v109.22,45.09 IC4.14
  Bottom 0.61: IC9.3 v95.57,18.73
A12_OUT
  Bottom 0.406: IC4.6 127,46.35 132.08,51.44 132.08,53.34 136.53,57.78 SV1.25
A13  (via drill 0.6 pad 1.42)
  Top 0.406: v75.25,47.62 v75.25,50.16 | v39.69,61.59 v39.69,51.44 | v56.2,50.16 v56.2,45.09 | v107.63,50.16 v107.63,43.81 | v62.87,45.09 v62.87,19.05
  Bottom 0.406: v75.25,50.16 82.55,50.16 83.82,51.44 U$3.26 87.63,51.44 88.9,50.16 v107.63,50.16 | v56.2,45.09 v62.87,45.09 62.87,46.99 63.5,47.62 66.67,47.62 67.94,46.35 73.98,46.35 v75.25,47.62 | v39.69,51.44 U$4.26 46.35,51.44 47.62,50.16 v56.2,50.16 | U$1.23 v39.69,61.59 | v107.63,43.81 IC4.13
  Bottom 0.813: v62.87,19.05 IC6.14
A13_OUT
  Bottom 0.406: IC4.7 127,45.09 133.03,51.12 133.03,53.02 136.53,56.52 140.34,56.52 SV1.26
A14  (via drill 0.6 pad 1.42)
  Top 0.406: v35.24,47.62 v35.24,64.14 | v57.78,46.35 v57.78,38.73 | v60.01,21.59 v60.01,38.73
  Bottom 0.406: v35.24,64.14 U$1.24 | v35.24,47.62 46.35,47.62 47.62,46.35 v57.78,46.35 U$4.1 | IC4.12 114.3,42.55 110.49,38.73 v57.78,38.73 v60.01,38.73
  Bottom 0.813: IC6.2 v60.01,21.59
A14_OUT
  Bottom 0.406: IC4.8 127,43.81 133.99,50.8 133.99,52.7 136.53,55.24 SV1.27
A15  (via drill 0.6 pad 1.42)
  Top 0.406: v52.39,65.41 v52.39,37.47 | v39.05,37.47 v39.05,21.59
  Bottom 0.406: U$1.25 U$4.20 46.35,66.67 47.62,65.41 v52.39,65.41 | IC4.11 114.3,41.27 110.49,37.47 v52.39,37.47 v39.05,37.47
  Bottom 0.61: IC5.13 IC5.12
  Bottom 0.813: IC5.13 v39.05,21.59
A15_OUT
  Bottom 0.406: IC4.9 127,42.55 134.94,50.48 134.94,52.39 136.53,53.98 140.34,53.98 SV1.28
BANK_A13  (via drill 0.6 pad 1.42)
  Top 0.406: v73.03,83.82 v73.03,50.16
  Bottom 0.406: U$2.26 66.67,51.44 67.94,50.16 v73.03,50.16 | IC2.2 81.28,87 80.33,86.04 75.25,86.04 v73.03,83.82
BANK_A14  (via drill 0.6 pad 1.42)
  Top 0.406: v78.11,82.55 v78.11,46.35
  Bottom 0.406: IC2.5 88.9,87.63 83.82,82.55 v78.11,82.55 | v78.11,46.35 U$2.1
CS_0
  Bottom 0.406: SV1.37 137.79,42.55 136.21,40.96 136.21,38.42 126.36,28.57 107.63,28.57 100.33,21.27 IC9.15
CS_1
  Bottom 0.406: IC9.14 100.33,18.73 109.22,27.62 126.68,27.62 137.16,38.1 137.16,40.64 137.79,41.27 140.34,41.27 SV1.38
CS_2
  Bottom 0.406: IC9.13 100.33,16.19 110.81,26.67 127,26.67 139.06,38.73 SV1.39
CS_3
  Bottom 0.406: IC9.12 100.33,13.65 112.39,25.72 127.32,25.72 SV1.40
CS_4
  Bottom 0.406: IC9.11 100.33,11.11 113.98,24.77 127.64,24.77 140.97,38.1 142.56,38.1 143.51,39.05 143.51,48.26 SV1.32
CS_373  (via drill 0.6 pad 1.42)
  Top 0.406: v70.17,102.55 v70.17,21.91
  Bottom 0.406: IC9.7 91.76,8.57 92.71,9.53 92.71,16.83 92.08,17.46 74.61,17.46 v70.17,21.91
  Bottom 0.61: IC10.1 IC10.2 v70.17,102.55
CS_BANKED_RAM  (via drill 0.6 pad 1.42)
  Top 0.406: v54.61,65.41 v54.61,15.24
  Bottom 0.406: U$2.20 63.5,66.67 62.23,65.41 v54.61,65.41 | v54.61,15.24 59.37,15.24 60.64,13.97 IC6.12
CS_EPROM  (via drill 0.6 pad 1.42)
  Top 0.406: v71.44,17.78 v71.44,65.41
  Bottom 0.406: U$3.20 83.82,66.67 82.55,65.41 v71.44,65.41 | IC6.5 58.74,13.97 60.01,12.7 67.94,12.7 71.44,16.19 v71.44,17.78
D0  (via drill 0.6 pad 1.42)
  Top 0.406: v74.93,83.82 v74.93,71.75 | v109.22,74.3 v109.22,83.19
  Bottom 0.406: U$1.33 28.57,87 26.04,84.45 26.04,76.2 29.21,73.03 46.35,73.03 47.62,71.75 U$4.11 62.23,71.75 63.5,73.03 66.67,73.03 67.94,71.75 v74.93,71.75 U$2.11 82.55,71.75 83.82,73.03 87.63,73.03 88.9,71.75 U$3.11 106.68,71.75 v109.22,74.3 | IC2.3 83.82,86.36 82.55,85.09 76.2,85.09 v74.93,83.82 | v109.22,83.19 SV1.5
D1  (via drill 0.6 pad 1.42)
  Top 0.406: v91.44,79.38 v91.44,74.3 | v107.31,76.2 v107.31,81.92
  Bottom 0.406: U$1.32 28.57,84.45 26.99,82.87 26.99,77.47 28.89,75.56 46.35,75.56 47.62,74.3 U$4.12 62.23,74.3 63.5,75.56 66.67,75.56 67.94,74.3 U$2.12 82.55,74.3 83.82,75.56 87.63,75.56 88.9,74.3 v91.44,74.3 U$3.12 105.41,74.3 v107.31,76.2 | IC2.4 86.36,89.53 87,90.17 89.53,90.17 90.17,89.53 90.17,87 91.44,85.72 v91.44,79.38 | v107.31,81.92 140.34,81.92 SV1.6
D2  (via drill 0.6 pad 1.42)
  Top 0.406: v93.98,79.38 v93.98,76.83 | v104.14,76.83 v104.14,80.64
  Bottom 0.406: U$1.31 28.57,81.92 27.94,81.28 27.94,78.74 28.57,78.11 46.35,78.11 47.62,76.83 U$4.13 62.23,76.83 63.5,78.11 66.67,78.11 67.94,76.83 U$2.13 82.55,76.83 83.82,78.11 87.63,78.11 88.9,76.83 v93.98,76.83 U$3.13 v104.14,76.83 | IC2.7 v93.98,79.38 | v104.14,80.64 SV1.7
D3
  Bottom 0.406: U$1.30 U$4.15 46.35,79.38 47.62,78.11 62.23,78.11 63.5,79.38 U$2.15 66.67,79.38 67.94,78.11 82.55,78.11 83.82,79.38 U$3.15 87.63,79.38 88.9,78.11 96.52,78.11 | 96.52,78.11 105.41,78.11 106.68,79.38 140.34,79.38 SV1.8 | IC2.8 96.52,78.11
D4  (via drill 0.6 pad 1.42)
  Top 0.406: v97.79,79.38 v97.79,75.56
  Bottom 0.406: U$1.29 U$4.16 46.35,76.83 47.62,75.56 62.23,75.56 63.5,76.83 U$2.16 66.67,76.83 67.94,75.56 82.55,75.56 83.82,76.83 U$3.16 87.63,76.83 88.9,75.56 v97.79,75.56 104.78,75.56 107.31,78.11 SV1.9 | IC2.13 96.52,90.81 97.79,89.53 v97.79,79.38
D5  (via drill 0.6 pad 1.42)
  Top 0.406: v95.25,81.28 v95.25,73.03
  Bottom 0.406: U$1.28 U$4.17 46.35,74.3 47.62,73.03 62.23,73.03 63.5,74.3 U$2.17 66.67,74.3 67.94,73.03 82.55,73.03 83.82,74.3 U$3.17 87.63,74.3 88.9,73.03 v95.25,73.03 106.05,73.03 109.86,76.83 140.34,76.83 SV1.10 | IC2.14 93.98,90.81 95.25,89.53 v95.25,81.28
D6  (via drill 0.6 pad 1.42)
  Top 0.406: v92.71,81.28 v92.71,70.48
  Bottom 0.406: U$1.27 U$4.18 46.35,71.75 47.62,70.48 62.23,70.48 63.5,71.75 U$2.18 66.67,71.75 67.94,70.48 82.55,70.48 83.82,71.75 U$3.18 87.63,71.75 88.9,70.48 v92.71,70.48 107.31,70.48 112.39,75.56 SV1.11 | IC2.17 86.36,94.3 87.63,93.03 91.44,93.03 92.71,91.76 v92.71,81.28
D7  (via drill 0.6 pad 1.42)
  Top 0.406: v76.83,83.82 v76.83,67.94
  Bottom 0.406: U$1.26 U$4.19 46.35,69.22 47.62,67.94 62.23,67.94 63.5,69.22 U$2.19 66.67,69.22 67.94,67.94 v76.83,67.94 82.55,67.94 83.82,69.22 U$3.19 87.63,69.22 88.9,67.94 106.36,67.94 112.71,74.3 140.34,74.3 SV1.12 | IC2.18 83.82,90.81 85.09,89.53 85.09,86.04 82.87,83.82 v76.83,83.82
FI2  (via drill 0.6 pad 1.42)
  Top 0.406: v25.4,31.11 v25.4,102.23
  Bottom 0.406: v25.4,102.23 U$1.39 | IC5.9 39.69,11.43 37.15,13.97 IC5.5 28.57,13.97 25.4,17.14 v25.4,31.11 26.99,31.11 27.62,30.48 125.73,30.48 134.3,39.05 134.3,41.59 137.79,45.09 SV1.35
GND  (via drill 0.6 pad 1.42)
  Top 0.61: v62.23,104.78 v62.23,109.86 | v76.2,109.86 v76.2,104.78 | v112.39,97.79 v112.39,89.53 | v125.73,85.72 v125.73,71.75 | v19.68,22.23 v29.84,22.23
  Top 0.813: v33.66,56.52 v33.66,40.96
  Bottom 0.813: QG1.7 52.07,82.55
  Bottom 1.016: 85.62,40.41 C3.2 85.7,40.38 | U$1.21 v33.66,56.52
  Bottom 1.27: 100.97,86.36 U$3.14 | 40.64,82.55 52.07,82.55 60.33,82.55 U$4.14
  pour Bottom (isolate 0.61, no thermals): 0,117.47 0,0 151.13,0 151.13,117.47
IRQ  (via drill 0.6 pad 1.42)
  Top 0.406: v19.86,94.61 v19.86,37.47
  Bottom 0.406: v19.86,37.47 26.99,37.47 29.21,35.24 125.41,35.24 130.49,40.32 130.49,42.86 137.16,49.53 137.16,50.8 137.79,51.44 140.34,51.44 SV1.30
  Bottom 0.61: U$1.4 R3.1 v19.86,94.61
N$1
  Bottom 0.406: IC1.1 39.69,100.97 38.42,99.69 38.42,94.3 39.37,93.34 IC1.4 44.45,93.34 45.72,94.61 49.85,94.61 50.48,93.98 50.48,91.76 49.53,90.81 IC1.10
  Bottom 0.61: IC1.1 44.45,100.97 | 44.45,100.97 R6.1 | 44.45,100.97 46.99,98.42 IC1.13
N$2
  Bottom 0.61: R2.1 U$1.38
N$3
  Bottom 0.61: IC2.19 R7.1
N$4
  Bottom 0.61: R7.2 LED1.K
N$5
  Bottom 0.61: R5.1 U$1.2
N$6
  Bottom 0.61: U$1.37 JP1.2
N$7
  Bottom 0.813: R10.1 QG1.1
N$8
  Bottom 0.406: IC1.3 45.09,95.89 46.35,97.16 50.8,97.16 52.7,95.25 52.7,88.27 55.24,85.72 QG1.8
N$9  (via drill 0.6 pad 1.42)
  Top 0.406: v43.81,98.42 v43.81,88.27
  Bottom 0.406: IC1.2 v43.81,98.42 | v43.81,88.27 IC1.6
N$10
  Bottom 0.406: IC1.12 50.16,95.89 51.44,94.61 51.44,87.63 49.53,85.72 IC1.8
N$11  (via drill 0.6 pad 1.42)
  Top 0.406: v95.25,92.08 v82.23,92.08
  Bottom 0.406: IC2.11 101.6,97.16 100.65,98.11 95.89,98.11 95.25,97.47 v95.25,92.08 | v82.23,92.08 76.2,92.08 73.98,89.85 IC10.8
N$12
  Bottom 0.61: IC10.9 IC10.10 IC10.11
N$13
  Bottom 0.61: IC10.3 70.17,100.01 72.71,102.55 IC10.13
N$14
  Bottom 0.61: IC10.6 69.22,92.39 70.8,93.98 70.8,98.42 72.39,100.01 IC10.12
N$15
  Bottom 0.406: IC2.6 91.44,90.17 90.17,91.44 87,91.44 85.09,93.34 R8.1
N$16
  Bottom 0.61: IC9.10 126.05,8.57 137.79,20.32 JP2.1
N$17
  Bottom 0.61: LED2.K 86.36,104.78 85.09,103.5 R8.2
N$18
  Bottom 0.406: IC5.10 39.69,13.97 34.61,19.05 IC5.3
N$19
  Bottom 0.406: IC6.4 60.01,16.51 61.28,15.24 67.31,15.24 68.58,16.51 68.58,20.32 67.31,21.59 IC6.15
N$20
  Bottom 0.61: IC9.6 86.68,11.11 R9.1
N$21
  Bottom 0.406: IC6.11 67.94,11.43 72.71,16.19 IC9.4
N$22
  Bottom 0.61: IC9.9 126.05,6.03 137.79,17.78 JP2.2
N$23  (via drill 0.6 pad 1.27)
  other vias: 5,112.31
N$24  (via drill 0.6 pad 1.27)
  other vias: 145.97,5
N$25  (via drill 0.6 pad 1.27)
  other vias: 145.97,112.31
N$37  (via drill 0.6 pad 1.27)
  other vias: 5,5
NMI  (via drill 0.6 pad 1.42)
  Top 0.406: v17.78,92.08 v17.78,36.2
  Bottom 0.406: v17.78,36.2 26.99,36.2 28.89,34.29 125.73,34.29 131.44,40.01 131.44,42.55 SV1.31
  Bottom 0.61: U$1.6 v17.78,92.08 R4.1
OUT_1
  Bottom 0.406: IC2.16 88.9,96.52 92.39,100.01 104.46,100.01 108.9,95.57 125.09,95.57 132.4,88.27 SV1.1
OUT_2
  Bottom 0.406: IC2.15 91.44,97.16 93.34,99.06 103.82,99.06 108.58,94.3 124.78,94.3 132.08,87 140.34,87 SV1.2
OUT_3
  Bottom 0.406: SV1.3 131.76,85.72 124.46,93.03 100.65,93.03 99.06,94.61 IC2.12
OUT_4
  Bottom 0.406: 99.06,88.9 IC2.9 99.06,90.17 100.65,91.76 124.14,91.76 131.44,84.45 140.34,84.45 SV1.4
RD  (via drill 0.6 pad 1.42)
  Top 0.406: v50.8,33.02 v50.8,60.33
  Bottom 0.406: U$4.22 46.35,61.59 47.62,60.33 v50.8,60.33 62.23,60.33 63.5,61.59 U$2.22 66.67,61.59 67.94,60.33 82.55,60.33 83.82,61.59 U$3.22 | IC5.6 26.99,11.43 22.54,15.88 22.54,32.07 24.13,33.66 27.62,33.66 28.26,33.02 v50.8,33.02 125.73,33.02 132.4,39.69 132.4,42.23 137.79,47.62 SV1.33
RST  (via drill 0.6 pad 1.42)
  Top 0.406: v27.94,104.78 v27.94,38.73
  Bottom 0.406: SV1.29 137.48,52.7 136.21,51.44 136.21,49.85 129.54,43.18 129.54,40.64 125.09,36.2 30.48,36.2 v27.94,38.73
  Bottom 0.61: R1.1 v27.94,104.78 U$1.40 IC7.1 PAD2.1
RW  (via drill 0.6 pad 1.42)
  Top 0.406: v26.67,29.53 v26.67,89.53
  Bottom 0.406: v26.67,89.53 U$1.34 | 34.92,16.51 IC5.4 31.75,16.51 | 31.75,16.51 28.57,16.51 26.67,18.41 v26.67,29.53 126.05,29.53 135.25,38.73 135.25,41.27 137.79,43.81 140.34,43.81 SV1.36 | 31.75,16.51 31.75,20.32 33.02,21.59 IC5.2
  Bottom 0.61: IC5.1 IC5.2
VCC  (via drill 0.6 pad 1.42, 0.6 pad 1.78)
  Top 0.61: v30.48,43.18 v30.48,26.04 | v119.38,71.12 v119.38,107.31 | v22.68,87 v22.68,43.18
  Bottom 0.406: C12.1 | C11.1 41.28,26.04 41.27,26.04 | C13.1 | C14.1 119.38,55.24 | C7.1 | R6.2 | C8.1 | R10.2
  Bottom 0.61: 119.38,69.22 v119.38,71.12 C5.1 | 119.38,69.22 119.38,55.24 119.38,52.7 IC4.20 | C15.+ | IC3.20 119.38,69.22
  Bottom 0.813: 22.71,92.1 R4.2 | C4.1 QG1.14
  Bottom 1.016: R5.2 | 85.7,43.18 C3.1 | R2.2 | R1.2 | v30.48,26.04 41.27,26.04 C12.1 86.36,26.04 | R9.2 86.04,25.72 86.36,26.04 | 86.36,26.04 C13.1
  Bottom 1.27: R4.2 v22.68,87 U$1.8 C6.1 | C1.1 C2.1 | U$2.28 C2.1 | U$4.28 C1.1 | U$3.28 C3.1 85.7,43.18 68.9,43.18 68.89,43.18 C2.1 | U$3.28 U$3.27 | U$3.1 U$3.28 | C1.1 | 22.71,92.1 R3.2 R2.2 | R2.2 R5.2 | R5.2 R1.2 | R1.2 C16.+ IC7.2 R6.2 C8.1 R10.2 59.69,107.31 | 59.69,107.31 QG1.14 | 59.69,107.31 73.03,107.31 | 73.03,107.31 78.74,107.31 | 78.74,107.31 C7.1 | 78.74,107.31 LED1.A C15.+ LED2.A C10.+ v119.38,107.31 127,107.31 134.62,99.69 JP3.2 | C2.1 | IC10.14 C9.1 73.03,107.33 73.03,107.31 | C11.1 IC5.14 | C12.1 IC6.16 | C13.1 IC9.16 | C7.1 IC2.20 | C8.1 IC1.14 | v30.48,43.18 v22.68,43.18 C1.1
WR  (via drill 0.6 pad 1.42)
  Top 0.406: v48.9,31.75 v48.9,47.62 | v68.9,47.62 v68.9,94.93
  Bottom 0.406: U$4.27 46.35,48.9 47.62,47.62 v48.9,47.62 62.23,47.62 63.5,48.9 U$2.27 66.67,48.9 67.94,47.62 v68.9,47.62 | IC5.8 40.64,8.89 36.83,12.7 27.94,12.7 23.81,16.83 23.81,31.75 24.77,32.7 26.99,32.7 27.94,31.75 v48.9,31.75 125.73,31.75 133.35,39.37 133.35,41.91 137.79,46.35 140.34,46.35 SV1.34
  Bottom 0.61: v68.9,94.93 IC10.5 IC10.4